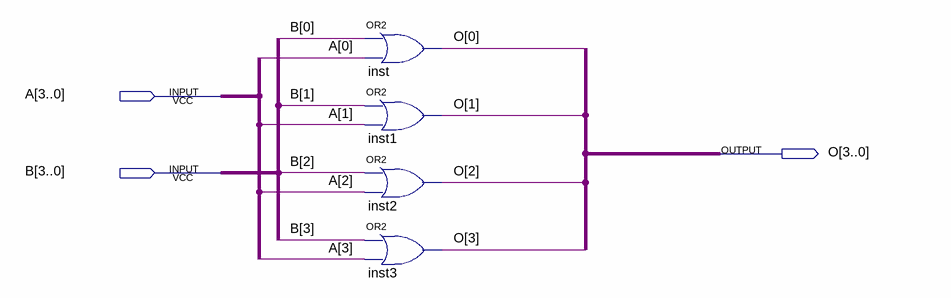
[diagram p0: schematic sheet]
// Quartus schematic fourbitor.bdf as structural Verilog: 4 symbols, 3 pins
module fourbitor (
  input  [3:0] A,
  input  [3:0] B,
  output [3:0] O
);

  or inst (O[0], B[0], A[0]);
  or inst1 (O[1], B[1], A[1]);
  or inst2 (O[2], B[2], A[2]);
  or inst3 (O[3], B[3], A[3]);
endmodule
